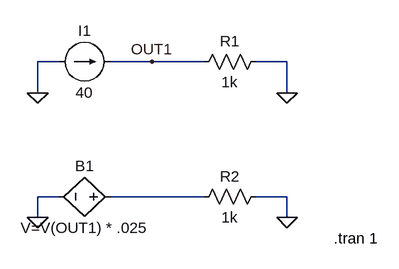
[diagram p0: schematic LEMV1.asc]
LEMV1.asc, the LTspice schematic file:
Version 4
SHEET 1 880 680
WIRE 48 240 16 240
WIRE 192 240 128 240
WIRE 272 240 192 240
WIRE 400 240 352 240
WIRE 16 288 16 240
WIRE 400 288 400 240
WIRE 48 448 16 448
WIRE 272 448 128 448
WIRE 400 448 352 448
WIRE 16 480 16 448
WIRE 400 480 400 448
FLAG 16 288 0
FLAG 400 288 0
FLAG 192 240 OUT1
FLAG 16 480 0
FLAG 400 480 0
SYMBOL current 48 240 R270
WINDOW 0 32 40 VTop 2
WINDOW 3 -32 40 VBottom 2
SYMATTR InstName I1
SYMATTR Value 40
SYMBOL bv 144 448 R90
WINDOW 0 -32 56 VBottom 2
WINDOW 3 32 56 VTop 2
SYMATTR InstName B1
SYMATTR Value V=V(OUT1) * .025
SYMBOL res 368 224 R90
WINDOW 0 0 56 VBottom 2
WINDOW 3 32 56 VTop 2
SYMATTR InstName R1
SYMATTR Value 1k
SYMBOL res 368 432 R90
WINDOW 0 0 56 VBottom 2
WINDOW 3 32 56 VTop 2
SYMATTR InstName R2
SYMATTR Value 1k
TEXT 472 512 Left 2 !.tran 1

The netlist it stands for:
* LEMV1.asc
I1 0 OUT1 40
B1 N001 0 V=V(OUT1) * .025
R1 0 OUT1 1k
R2 0 N001 1k
.tran 1
.backanno
.end